# Altium schematic sheet Soft_Start.SchDoc: Soft Start For Geec Power Electronics
size A4; SheetNumber: 5; SheetTotal: 6
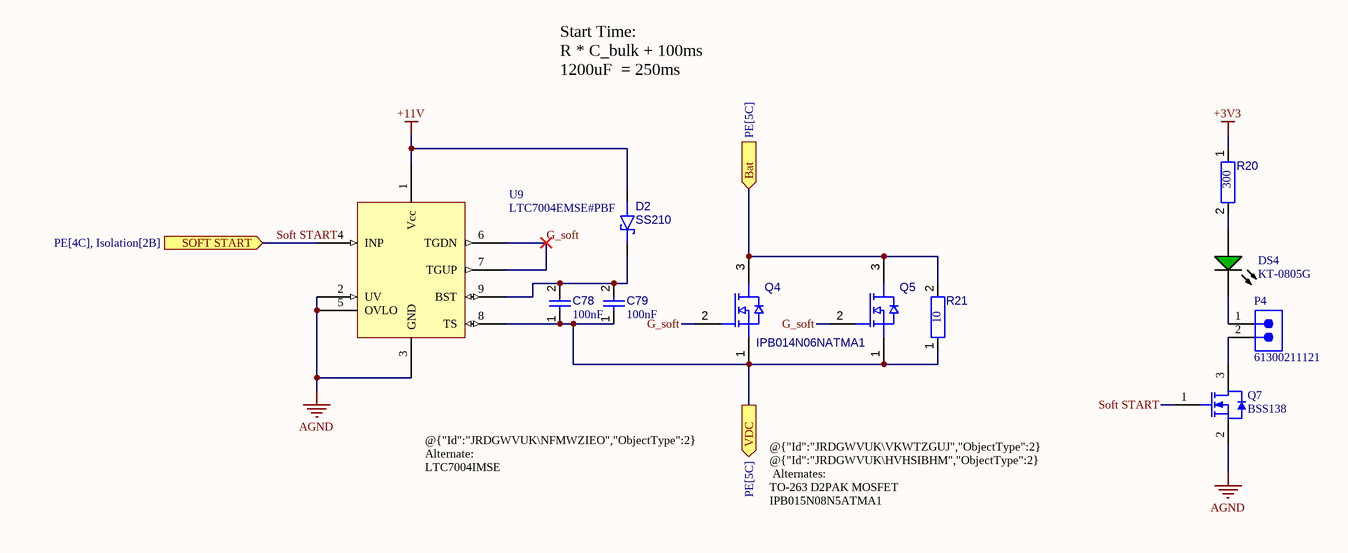
[diagram p0: Soft_Start.SchDoc]

## Parts
C78  value 100nF  [CAPC3216X06N]  (hidden comment: C1206C104K1RACTU)
C79  value 100nF  [CAPC3216X06N]  (hidden comment: C1206C104K1RACTU)
D2  SS210  [DIOM4226X24N]
DS4  KT-0805G  [WL-SMCW_0805_150080xx75000]
P4  61300211121  [61300211121]
Q4  IPB014N06NATMA1  [INF-PG-TO263-7-1_M]
Q5  IPB014N06NATMA1  [INF-PG-TO263-7-1_M]  (value not drawn)
Q7  BSS138  [FAIR-SOT23-3_V]
R20  value 300  [RESC3216X89X51NL25T25]  (hidden comment: 1206W4F3000T5E)
R21  value 10  [1623730-2-Footprint-1]  (hidden comment: 1623730-2)
U9  LTC7004EMSE#PBF  [TSSOP50P490X110_HS-11N]

## Ports
Bat (in, see PE[5C]), SOFT START (in, see PE[4C], Isolation[2B]), VDC (out, see PE[5C])

## Nets
+3V3: R20.1
+11V: D2.2(A) U9.1(Vcc)
AGND: Q7.2(S) U9.2(UV) U9.3(GND) U9.5(OVLO)
Bat: Q4.3(D) Q5.3(D) R21.2 ; port Bat
G_soft: Q4.2(G) Q5.2(G) U9.6(TGDN) U9.7(TGUP)
Soft START: Q7.1(G) U9.4(INP) ; port SOFT START
VDC: C78.1 C79.1 Q4.1(S) Q5.1(S) R21.1 U9.8(TS) ; port VDC
NetC78_2: C78.2 C79.2 D2.1(K) U9.9(BST)
NetDS4_1: DS4.1(A) R20.2
NetDS4_2: DS4.2(K) P4.1
NetP4_2: P4.2 Q7.3(D)

## Notes on the sheet
- Start Time:
  R * C_bulk + 100ms
  1200uF  = 250ms
- @{"Id":"JRDGWVUK\NFMWZIEO","ObjectType":2} Alternate:
  LTC7004IMSE
- @{"Id":"JRDGWVUK\VKWTZGUJ","ObjectType":2} @{"Id":"JRDGWVUK\HVHSIBHM","ObjectType":2}
  Alternates:
  TO-263 D2PAK MOSFET
  IPB015N08N5ATMA1

## Library data of the parts
C78 C79 = CMP-001-00083-1: Ceramic Capacitor, Multilayer, Ceramic, 200V, 10% +Tol, 10% -Tol, X7R, 15% TC, 0.01uF, 1206; Voltage Rating: 100V; Case/Package: 1206; Pins: 2; Mounting Technology: Surface Mount; Min Operating Temperature: -55°C; Max Operating Temperature: 125°C; Tolerance: 10%
D2 = CMP-004-00033-2: Rectifier Diode, Schottky, 1 Phase, 1 Element, 2A, 100V V(RRM), Silicon, DO-214AA; Forward Voltage: 850mV; Pins: 2; Min Operating Temperature: -65°C; Max Operating Temperature: 150°C; JLCPN: C14996; Case/Package: SMB; Forward Current: 2A
DS4 = CMP-007-00037-1: -40℃~+85℃ 100mW 120° 2.6V~3.1V 430mcd 513nm~528nm 525nm 5mA Emerald Green 0805 LED Indication - Discrete ROHS; Colour: Green; Case/Package: 0805; JLCPN: C2297
P4 = CMP-002-00208-1: WR-PHD Pin Header, THT, Vertical, pitch 2.54mm, 1 Row, 2P; Manufacturer: Wurth Elektronik; Withstanding Voltage: 500V; Rated Current: 3A; Contact Resistance: 20mOhm; Working Voltage: 250V; Source: WR-PHD.SchLib; Mount: Through Hole; ComponentLink1Description: Website Link; Operating Temperature Max: 105°C; ComponentLink1URL: https://www.we-online.com/redexpert/article/61300211121?ad; Category: Board-to-Board Connectors; ComponentLink2URL: https://www.we-online.com/redexpert/spec/61300211121?ad; Number of Rows: 1; Orientation: Vertical; ComponentLink2Description: Datasheet Link; Operating Temperature Min: -40°C; Manufacturer Part Number: 61300211121; Match Code: WR-PHD; Design Item ID: 61300211121; Component Type: Standard; Pin Count: 2; Gender: Pin Header; Pitch: 2.54mm; Packaging: Bag; Pins: 2
Q4 Q5 = CMP-00000-5: Power MOSFET, N Channel, 60 V, 180 A, 0.0012 ohm, TO-263 (D2PAK), Surface Mount; pin to pad: 1>2+3+5+6+7 2>1 3>8; Drain to Source Breakdown Voltage: 60V; Drain to Source Resistance: 1.4mΩ; Continuous Drain Current (ID): 34A; Max Power Dissipation: 214W; Gate to Source Voltage (Vgs): 20V; Case/Package: TO-263-7; Drain to Source Voltage (Vdss): 60V
Q7 = CMP-013-00021-4: N-Channel Logic Level Enhancement Mode Field Effect Transistor, 220 mA, 50 V, -55 to 150 degC, 3-Pin SOT-23, RoHS, Tape and Reel; Manufacturer: Fairchild; Elements: 1; Nominal Vgs: 1.3V; Resistance: 0.7Ohm; Typical Rise Time: 9ns; Rds On Max: 3.5Ohm; Nominal Dual Supply Voltage: 50V; Input Capacitance: 27pF; Package Version: Rev. 12, 03/2016; Power: 360mW; Packaging: TapeandReel; Package Description: 3-Pin Small Outline Transistor, Body 2.92 x 1.325 mm, Pitch 0.95 mm; Datasheet URL: https://www.fairchildsemi.com/datasheets/BS/BSS138.pdf; Min Operating Temperature: -55°C; Pins: 3; RoHS Compliant: True; Package Reference: SOT23-3; Package Quantity: 1; Case/Package: TO-236-3; Mounting Technology: SM; Max Operating Temperature: 150°C; Datasheet Version: Rev. C, 10/2005
R20 = CMP-009-00190-1: 250mW Thick Film Resistors 200V ±100ppm/℃ ±1% 300Ω 1206 Chip Resistor - Surface Mount ROHS
R21 = CMP-009-00189-1: Fixed Resistor, Wire Wound, 4W, 10ohm, 6.3246V, 5% +/-Tol, 400ppm/Cel, Through Hole Mount, 3228; Voltage Rating: 6.3V; Pins: 2; Case/Package: Axial; Max Operating Temperature: 275°C; Tolerance: 5%; Mounting Technology: Axial, Through Hole; Min Operating Temperature: -55°C
U9 = CMP-00024-00007-2: RoHS Compliant PRODUCTION (Last Updated: 2weeks ago) MSOP IC Gate Driver; pin to pad: 3>3+11; Case/Package: MSOP; Pins: 10